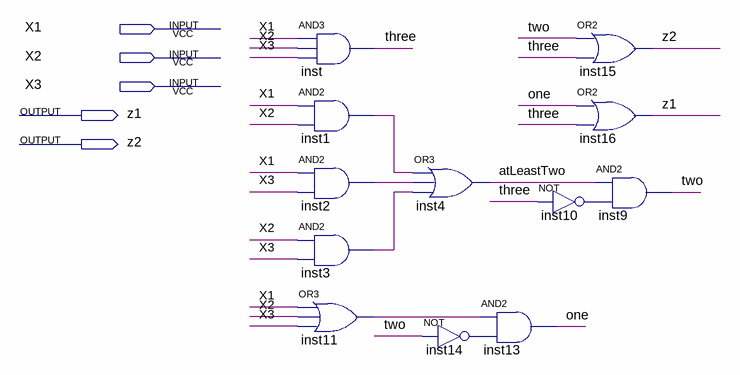
[diagram p0: schematic sheet]
// Quartus schematic zadatak1.bdf as structural Verilog: 12 symbols, 5 pins
module zadatak1 (
  input  X1,
  input  X2,
  input  X3,
  output z1,
  output z2
);

  wire atLeastTwo, inst1_out, inst2_out, inst3_out, inst10_out, inst11_out, inst14_out, one, three, two;

  and inst (three, X1, X2, X3);
  and inst1 (inst1_out, X1, X2);
  and inst2 (inst2_out, X1, X3);
  and inst3 (inst3_out, X2, X3);
  or inst11 (inst11_out, X1, X2, X3);
  or inst4 (atLeastTwo, inst1_out, inst2_out, inst3_out);
  not inst14 (inst14_out, two);
  and inst13 (one, inst11_out, inst14_out);
  or inst15 (z2, two, three);
  or inst16 (z1, one, three);
  and inst9 (two, atLeastTwo, inst10_out);
  not inst10 (inst10_out, three);
endmodule
